# EAGLE schematic APP_UD_red_588 (EAGLE 6.1)
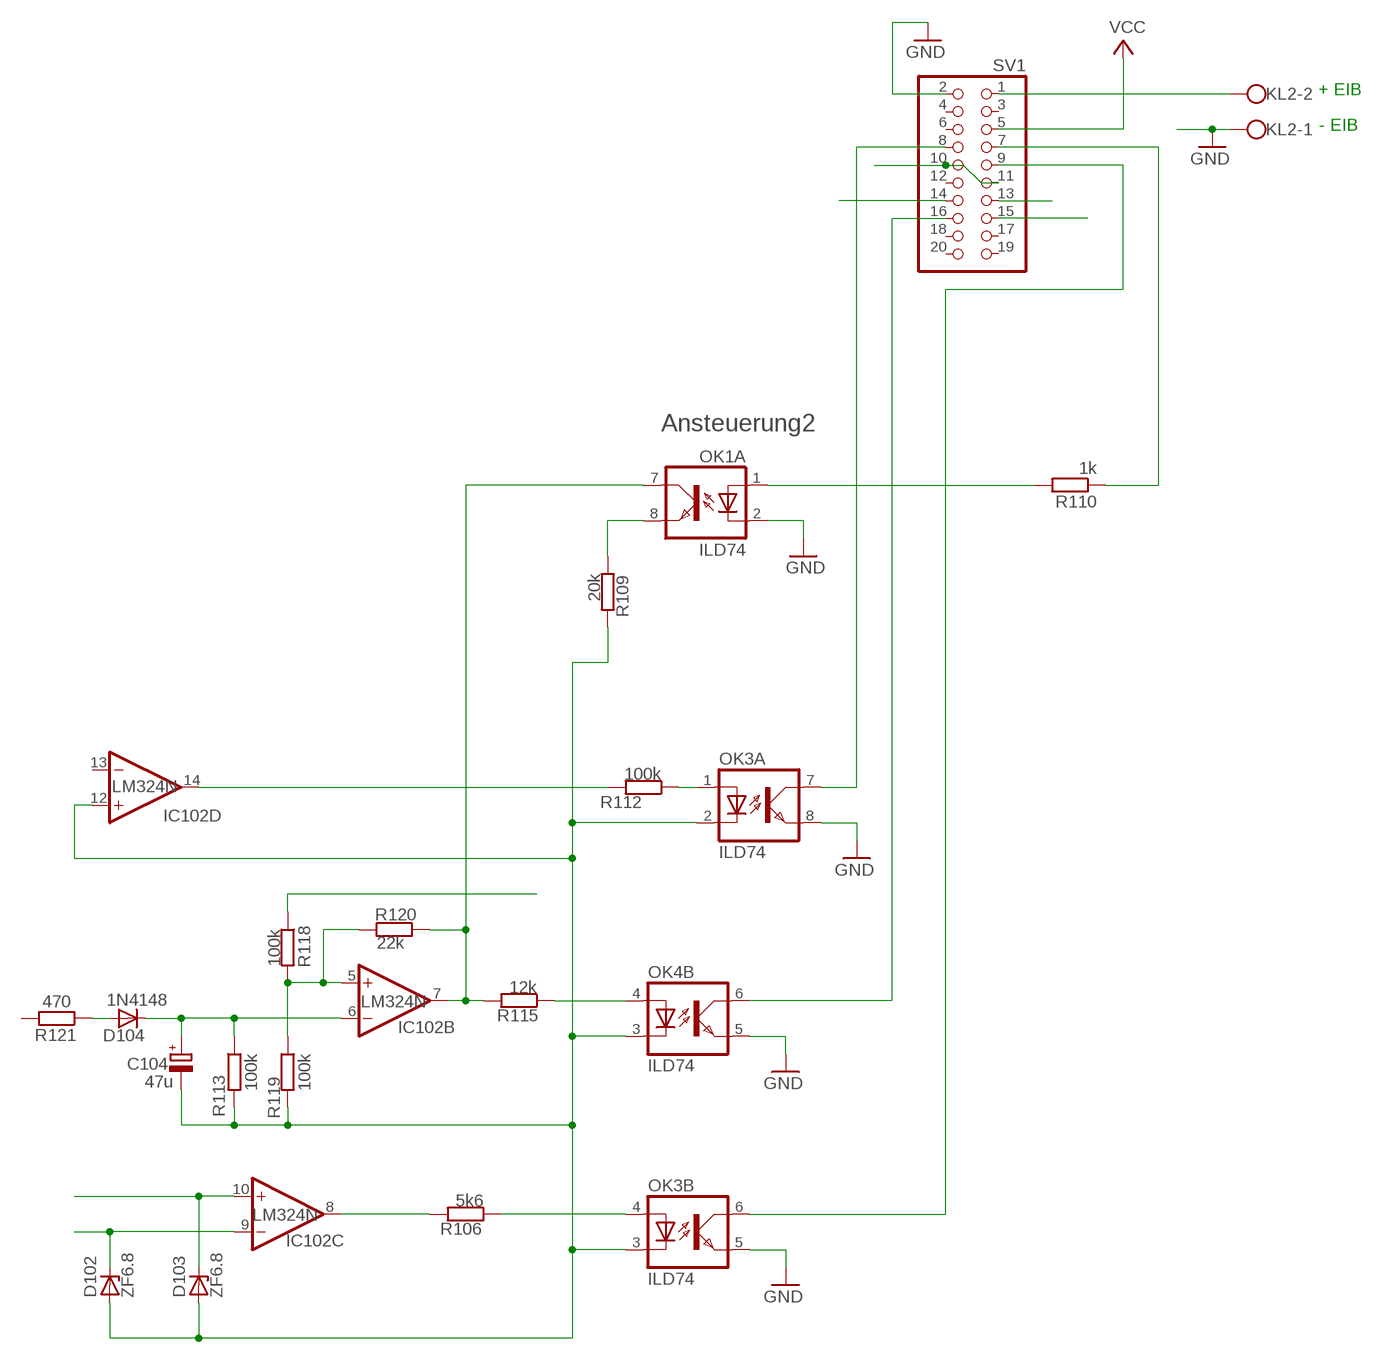
[diagram p0: schematic, sheet 1]

## Parts
C104  47u  CPOL-EUE2-5  [E2-5]
D102  ZF6.8  ZENER-DIODEZD-5  [ZDIO-5]
D103  ZF6.8  ZENER-DIODEZD-7.5  [ZDIO-7.5]
D104  1N4148  1N4148DO35-7S  [D-7]
IC102  LM324N  [DIL14]
KL2  W237-102  [W237-102]
OK1  ILD74  ILD2  [DIL08]
OK3  ILD74  ILD2  [DIL08]
OK4  ILD74  ILD2  [DIL08]
R106  5k6  R-EU_0204/7  [0204/7]
R109  20k  R-EU_0204/7  [0204/7]
R110  1k  R-EU_0204/7  [0204/7]
R112  100k  R-EU_0207/15  [0207/15]
R113  100k  R-EU_0204/7  [0204/7]
R115  12k  R-EU_0204/7  [0204/7]
R118  100k  R-EU_0204/7  [0204/7]
R119  100k  R-EU_0204/7  [0204/7]
R120  22k  R-EU_0204/7  [0204/7]
R121  470  R-EU_0204/7  [0204/7]
SV1  PINHD-2X10  [2X10]

## Nets
AGND2: C104.- D102.A D103.A IC102.12(D:+IN) OK3.2(A:C) OK3.3(B:C) OK4.3(B:C) R109.2 R113.2 R119.2
GND: KL2.1 OK1.2(A:C) OK3.5(B:EMIT) OK3.8(A:EMIT) OK4.5(B:EMIT) SV1.2
N$1: SV1.15
N$5: SV1.13
N$7: SV1.10 SV1.11
N$10: OK1.1(A:A) R110.2
N$14: IC102.7(B:OUT) OK1.7(A:COL) R115.2 R120.2
N$20: KL2.2 SV1.1
N$27: OK3.1(A:A) R112.1
N$33: SV1.14
N$36: OK1.8(A:EMIT) R109.1
N$43: D103.C IC102.10(C:+IN)
N$44: D102.C IC102.9(C:-IN)
N$45: OK3.4(B:A) R106.1
N$46: IC102.8(C:OUT) R106.2
N$50: OK3.6(B:COL) SV1.9
N$51: OK3.7(A:COL) SV1.8
N$52: R110.1 SV1.7
N$60: C104.+ D104.C IC102.6(B:-IN) R113.1
N$61: OK4.4(B:A) R115.1
N$62: OK4.6(B:COL) SV1.16
N$65: D104.A R121.1
N$66: IC102.5(B:+IN) R118.2 R119.1 R120.1
N$72: IC102.14(D:OUT) R112.2
V12-C2: R118.1
VCC: SV1.5
Unconnected: IC102.1(A:OUT) IC102.2(A:-IN) IC102.3(A:+IN) IC102.13(D:-IN) OK1.3(B:C) OK1.4(B:A) OK1.5(B:EMIT) OK1.6(B:COL) OK4.1(A:A) OK4.2(A:C) OK4.7(A:COL) OK4.8(A:EMIT) R121.2 SV1.3 SV1.4 SV1.6 SV1.12 SV1.17 SV1.18 SV1.19 SV1.20

## Notes on the sheet
- + EIB
- - EIB
- Ansteuerung2

## Power pins joined to a net without a drawn wire
V+: IC102.4(P:V+)
V-: IC102.11(P:V-)

## Library data of the parts
C104 = rcl:CPOL-EU: POLARIZED CAPACITOR, European symbol
D102 D103 = diode:ZENER-DIODE: Z-Diode
D104 = diode:1N4148: DIODE high speed (Philips)
IC102 = linear:LM324: OP AMP
KL2 = con-wago-500:W237-102: WAGO SCREW CLAMP
OK1 OK3 OK4 = optocoupler:ILD2: SIEMENS OPTO COUPLER
R106 R109 R110 R112 R113 R115 R118-R121 = rcl:R-EU_: RESISTOR, European symbol
SV1 = pinhead:PINHD-2X10: PIN HEADER